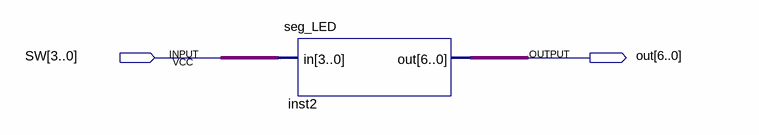
[diagram p0: schematic sheet]
// Quartus schematic segLED.bdf as structural Verilog: 1 symbols, 2 pins
module segLED (
  input  [3:0] SW,
  output [6:0] out
);

  seg_LED inst2 (.in(SW), .out(out));
endmodule
